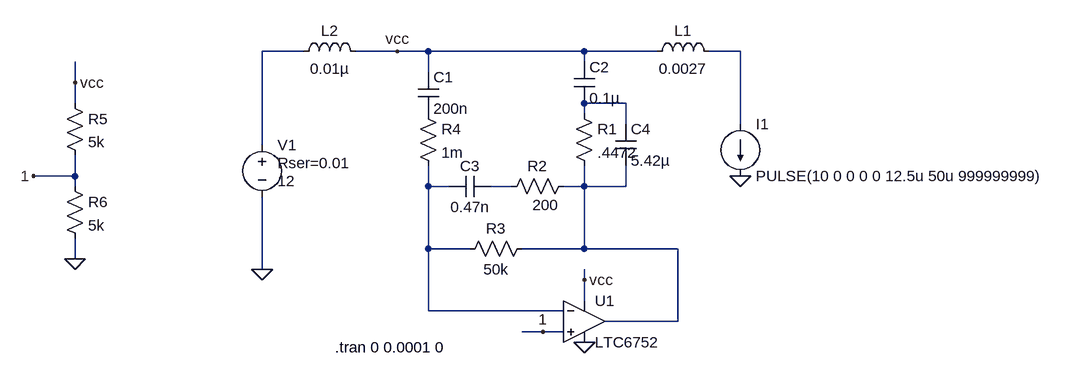
[diagram p0: schematic Draft4.asc]
Draft4.asc, the LTspice schematic file:
Version 4
SHEET 1 3444 680
WIRE -160 0 -224 0
WIRE -16 0 -80 0
WIRE 32 0 -16 0
WIRE 272 0 32 0
WIRE 384 0 272 0
WIRE 512 0 464 0
WIRE 272 16 272 0
WIRE 32 32 32 0
WIRE -512 48 -512 16
WIRE -512 80 -512 48
WIRE 336 80 272 80
WIRE 272 96 272 80
WIRE 336 112 336 80
WIRE 512 112 512 0
WIRE -224 144 -224 0
WIRE -512 192 -512 160
WIRE -512 192 -576 192
WIRE -512 208 -512 192
WIRE 32 208 32 176
WIRE 64 208 32 208
WIRE 160 208 128 208
WIRE 272 208 272 176
WIRE 272 208 240 208
WIRE 336 208 336 176
WIRE 336 208 272 208
WIRE 32 304 32 208
WIRE 96 304 32 304
WIRE 272 304 272 208
WIRE 272 304 176 304
WIRE 416 304 272 304
WIRE -512 320 -512 288
WIRE -224 336 -224 224
WIRE 272 352 272 336
WIRE 272 384 272 352
WIRE 32 400 32 304
WIRE 240 400 32 400
WIRE 416 416 416 304
WIRE 416 416 304 416
WIRE 208 432 176 432
WIRE 240 432 208 432
FLAG 272 448 0
FLAG -224 336 0
FLAG -16 0 vcc
FLAG 272 352 vcc
FLAG -576 192 1
FLAG 208 432 1
FLAG 512 192 0
FLAG -512 320 0
FLAG -512 48 vcc
SYMBOL voltage -224 128 R0
WINDOW 123 0 0 Left 0
WINDOW 39 24 44 Left 2
WINDOW 3 24 72 Left 2
SYMATTR SpiceLine Rser=0.01
SYMATTR Value 12
SYMATTR InstName V1
SYMBOL cap 16 32 R0
SYMATTR InstName C1
SYMATTR Value 200n
SYMBOL cap 256 16 R0
SYMATTR InstName C2
SYMATTR Value 0.1µ
SYMBOL res 256 80 R0
SYMATTR InstName R1
SYMATTR Value .4472
SYMBOL cap 128 192 R90
WINDOW 0 0 32 VBottom 2
WINDOW 3 32 32 VTop 2
SYMATTR InstName C3
SYMATTR Value 0.47n
SYMBOL res 256 192 R90
WINDOW 0 0 56 VBottom 2
WINDOW 3 29 44 VTop 2
SYMATTR InstName R2
SYMATTR Value 200
SYMBOL res 192 288 R90
WINDOW 0 0 56 VBottom 2
WINDOW 3 32 56 VTop 2
SYMATTR InstName R3
SYMATTR Value 50k
SYMBOL ind 368 16 R270
WINDOW 0 32 56 VTop 2
WINDOW 3 5 56 VBottom 2
SYMATTR InstName L1
SYMATTR Value 0.0027
SYMBOL ind -176 16 R270
WINDOW 0 32 56 VTop 2
WINDOW 3 5 56 VBottom 2
SYMATTR InstName L2
SYMATTR Value 0.01µ
SYMBOL res 16 80 R0
SYMATTR InstName R4
SYMATTR Value 1m
SYMBOL Comparators\\LTC6752 272 352 R0
SYMATTR InstName U1
SYMBOL current 512 112 R0
WINDOW 123 0 0 Left 0
WINDOW 39 0 0 Left 0
SYMATTR InstName I1
SYMATTR Value PULSE(10 0 0 0 0 12.5u 50u 999999999)
SYMBOL res -528 64 R0
SYMATTR InstName R5
SYMATTR Value 5k
SYMBOL res -528 192 R0
SYMATTR InstName R6
SYMATTR Value 5k
SYMBOL cap 320 112 R0
SYMATTR InstName C4
SYMATTR Value 5.42µ
TEXT -112 456 Left 2 !.tran 0 0.0001 0

The netlist it stands for:
* Draft4.asc
V1 N001 0 12 Rser=0.01
C1 vcc P001 200n
C2 vcc N003 0.1µ
R1 N003 N006 .4472
C3 N005 N004 0.47n
R2 N006 N005 200
R3 N006 N004 50k
L1 vcc N002 0.0027
L2 N001 vcc 0.01µ
R4 P001 N004 1m
XU1 1 N004 vcc 0 N006 LTC6752  ; pins In+ In- V+ V- OUT
I1 N002 0 PULSE(10 0 0 0 0 12.5u 50u 999999999)
R5 vcc 1 5k
R6 1 0 5k
C4 N003 N006 5.42µ
.tran 0 0.0001 0
.lib LTC7.lib
.backanno
.end